# Altium project RS232ToWifi.PrjPcb
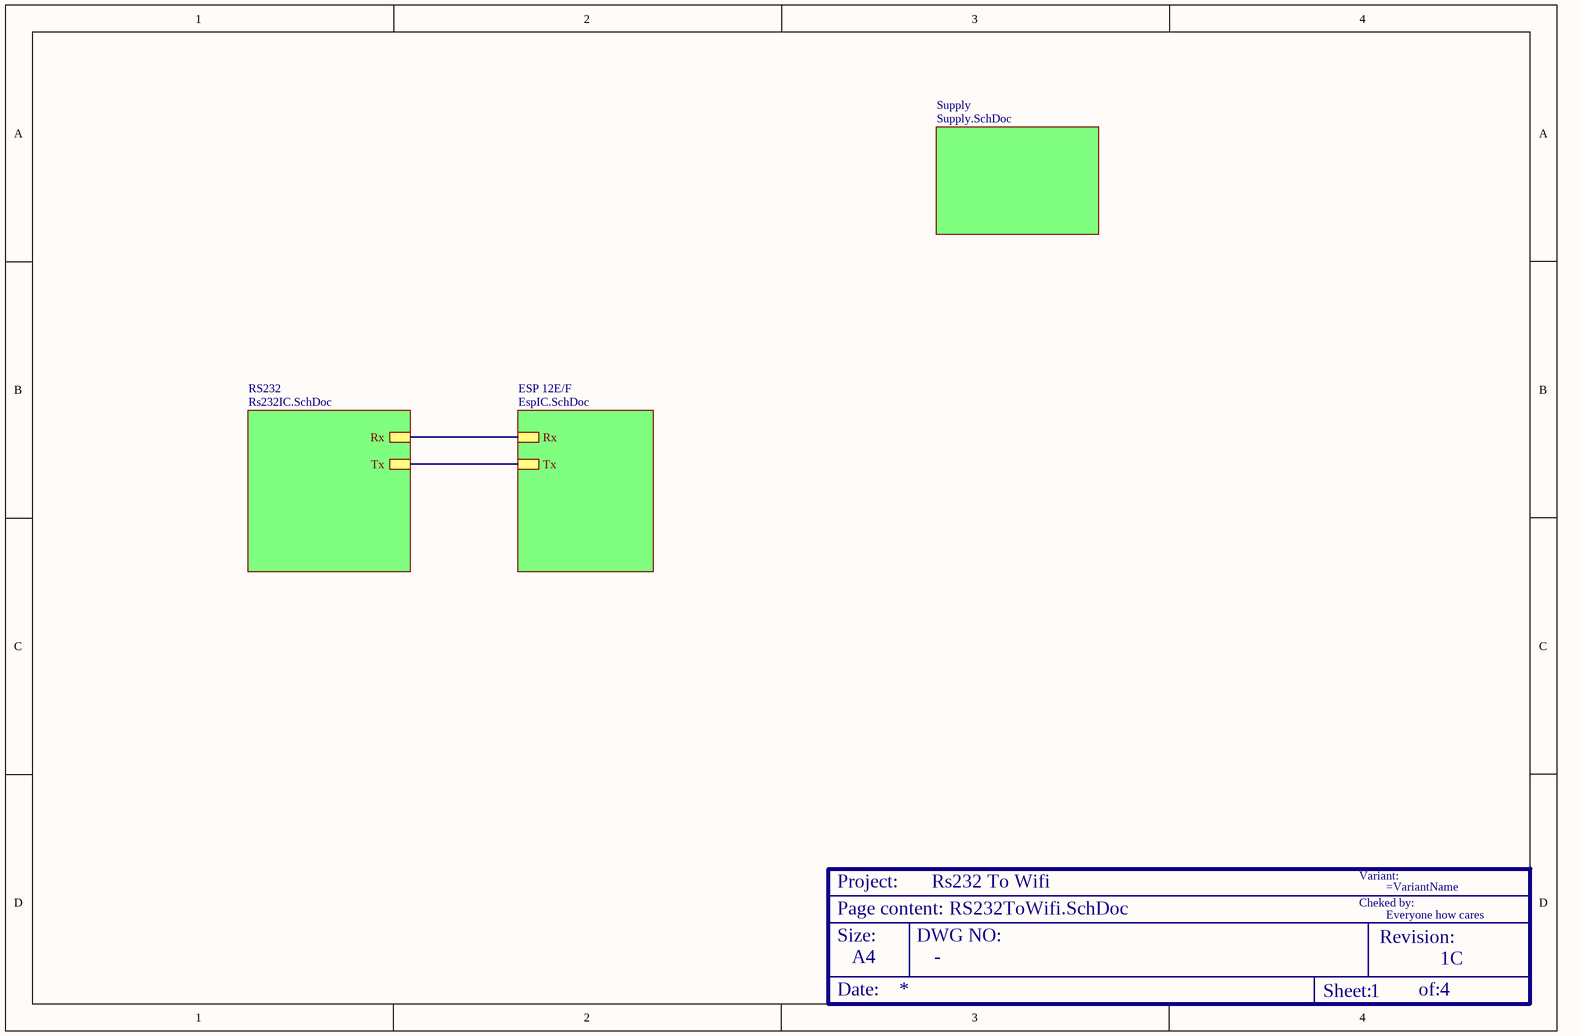
[diagram p0: RS232ToWifi.SchDoc]
P_revision: 1C; P_title: Rs232 To Wifi
4 sheets, 38 parts. Net scope: hierarchical (ports join the sheet entries above them; power ports are global).
Board file: 1551KBK.PcbDoc
Sheets:
  RS232ToWifi.SchDoc
    Supply = Supply.SchDoc
    RS232 = Rs232IC.SchDoc
    ESP 12E/F = EspIC.SchDoc

## Sheet RS232ToWifi.SchDoc
size A4; CheckedBy: Everyone how cares; DocumentNumber: 1; SheetNumber: 1; SheetTotal: 4

### Parts
(Parts that share a designator on the sheet are numbered #1, #2 ... from top to bottom, then left to right.)
?#1  Size: A4  (hidden comment: TitleBox)  (graphical)

### Sub-sheets
ESP 12E/F = EspIC.SchDoc: Tx, Rx
RS232 = Rs232IC.SchDoc: Rx, Tx
Supply = Supply.SchDoc: no entries

### Nets
Rx: sheet RS232/Rx, sheet ESP 12E/F/Rx
Tx: sheet RS232/Tx, sheet ESP 12E/F/Tx

### Notes on the sheet
- (in symbol TitleBox_1) Variant:; Project:; Cheked by:; Page content:; Size:; DWG NO:; Revision:; Date:; Sheet:; of:

### Library data of the parts
?#1 = TitleBox_1: coordenadas: (610;20) Size A4; DWG No: -

## Sheet Supply.SchDoc
size A4; CheckedBy: Everyone how cares; DocumentNumber: 2; SheetNumber: 2; SheetTotal: 4
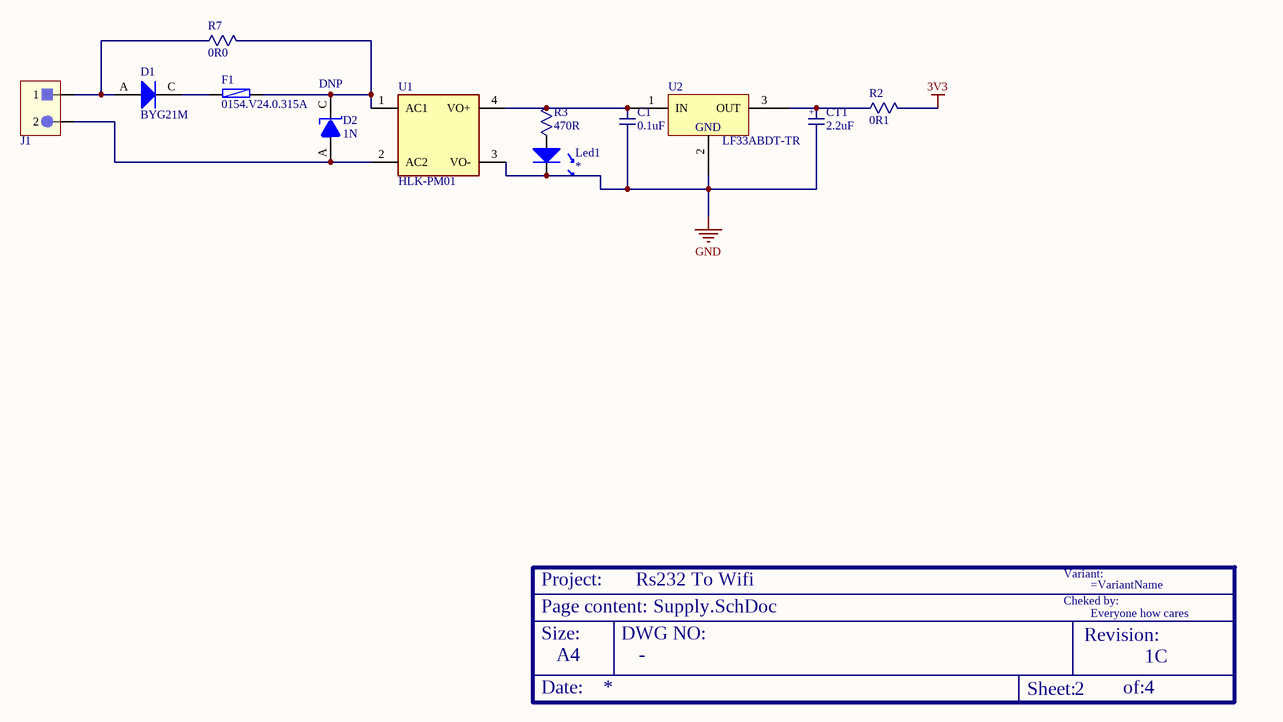
[diagram p1: Supply.SchDoc]

### Parts
(Parts that share a designator on the sheet are numbered #1, #2 ... from top to bottom, then left to right.)
?#2  Size: A4  (hidden comment: TitleBox)  (graphical)
C1  value 0.1uF  [0603C]  (hidden comment: Ceramic Capacitor)
CT1  value 2.2uF  [1206T]  (hidden comment: Tantalum capacitor)
D1  value BYG21M  [DO-214AC]  (hidden comment: DNP)
D2  DNP  value 1N  [1N5359BG]
F1  value 0154.V24.0.315A  [Fuseholder154]  (hidden comment: DNP)
J1  Conector  [691313510002]  (value not drawn)
Led1  Led  [LED_5MM_RED_1C-2A]  (value not drawn)
R2  value 0R1  [0603]  (hidden comment: Res)
R3  value 470R  [0603]  (hidden comment: Res)
R7  value 0R0  [0805]  (hidden comment: Res)
U1  HLK-PM01  [HLK-PM01/ISE]
U2  value LF33ABDT-TR  [DPAK-TO-252-3, CASE369C]  (hidden comment: LDO)

### Nets
3V3: R2.2
GND: C1.2 CT1.2 Led1.C U1.3(VO-) U2.2(GND)
NetC1_1: C1.1 R3.2 U1.4(VO+) U2.1(IN)
NetCT1_1: CT1.1 R2.1 U2.3(OUT)
NetD1_A: D1.A J1.1 R7.1
NetD1_C: D1.C F1.1
NetD2_A: D2.A J1.2 U1.2(AC2)
NetD2_C: D2.C F1.2 R7.2 U1.1(AC1)
NetLed1_A: Led1.A R3.1

### Notes on the sheet
- (in symbol CT) +
- (in symbol TitleBox_1) Variant:; Project:; Cheked by:; Page content:; Size:; DWG NO:; Revision:; Date:; Sheet:; of:

### Library data of the parts
?#2 = TitleBox_1: coordenadas: (610;20) Size A4; DWG No: -
C1 = CC: notas: *
CT1 = CT: Condensador Tantalum; notas: *
D1 = Diode: notas: 24Vin
D2 = Zener Diode: notas: *
F1 = Fusivel_LITTELFUSE_0154: Fusivel SMD LITTELFUSE  0154; notas: 24Vin
J1 = Conector 2 pins: notas: *
R7 = Res: notas: AC
U1 = HLK-PM01: HI-LINK Ultra-compact power module HLK-PM01<p> <ul> <li>Meet UL, CE requirements</li> <li>Ultra-thin, ultra-small</li> <li>All voltage input (AC: 90 ~ 264V)</li> <li>Low ripple and low noise</li> <li>Output overload and short circuit protection</li> <li>High efficiency, high power density</li> <li>The product is designed to meet the requirements of EMC and Safety Test</li> <li>Low power consumption, environmental protection, no-load loss <0.1W</li> <li>100% load aging and testing</li>; Availability: Unavailable; Price: None; SnapEDA_Link: https://www.snapeda.com/parts/hlk-pm01/Hi-link/view-part/2875605/?ref=snap; Value: *; Package: Package Analog Devices; MF: Hi-link; MP: hlk-pm01
U2 = LF33ABDT-TR: ST, LF33ABDT-TR, Fixed LDO Voltage Regulator, 3V to 16V, 400mV Dropout, 3.3Vout, 0.5Aout, TO-252-3; Manufacturer: STMICROELECTRONICS; Input Voltage Min: 3; Input Voltage Max: 16; Output Voltage Nom.: 3.3; Output Current: 0.5; Dropout Voltage Vdo: 400; LDO Regulator Case Style: TO-252; SVHC: No SVHC (15-Jun-2015); Accuracy %: 1%; Base Number: 33; No. of Outputs: 1; Operating Voltage Tolerance +: 2%; Primary Input Voltage: 5.3; Supply Voltage Min: 4.3; Voltage Regulator Type: Fixed<!--FANDB--><div class="features-and-benefits-container"><div class="features-and-benefits-description"><span class="features-benefits-value">The LF33ABDT-TR is a Low-drop Voltage Regulator with inhibit function and 3.3V output voltage. Low quiescent current make it particularly suitable for low-noise, low power applications and especially in battery powered systems. In the 5-pin configuration (PPAK) a shutdown logic control function is available (pin 2, TTL compatible). This means that when the device is used as a local regulator, a part of the board can be put in standby, decreasing the total power consumption. In the 3-terminal configuration, the device has the same electrical performance, but it is fixed in ON state. It requires a capacitor of only 2.2µF for stability, saving board space and costs.</span></div><div class="features-and-benefits-list"><ul class="features-and-benefits-list-list"><li class="features-and-benefits-list-item">Very low drop-out voltage (0.45V)</li><li class="features-and-benefits-list-item">Very low quiescent current (typical 50µA in OFF mode, 500µA in ON mode)</li><li class="features-and-benefits-list-item">500mA Output current</li><li class="features-and-benefits-list-item">Logic-controlled electronic shutdown</li><li class="features-and-benefits-list-item">Internal current and thermal limit</li><li class="features-and-benefits-list-item">Available in ±1% (AB) or ±2% (C) selection at 25°C</li><li class="features-and-benefits-list-item">80; Supplier 1: Farnell; Manufacturer Part Number: LF33ABDT-TR; RoHS: YES; Stock 1: 7182; Pricing 1: 1=0,52, 70=0,33, 200=0,297, 750=0,264, 1250=0,25 (EUR); No. of Pins: 3; Operating Temperature Min: -40; Operating Temperature Max: 125; Packaging: Cut Tape; MSL: -; Operating Temperature Range: -40°C to +125; Supply Voltage Max: 16; Termination Type: SMD; ComponentLink1URL: http://www.farnell.com/datasheets/1902868.pdf; ComponentLink1Description: http://www.farnell.com/datasheets/1902868.pdf; Supplier Part Number 1: 1087183; notas: *
Led1 = Led: notas: *; Value: *
R2 R3 = Res: notas: *

## Sheet Rs232IC.SchDoc
size A4; CheckedBy: Everyone; DocumentNumber: 3; SheetNumber: 3; SheetTotal: 4
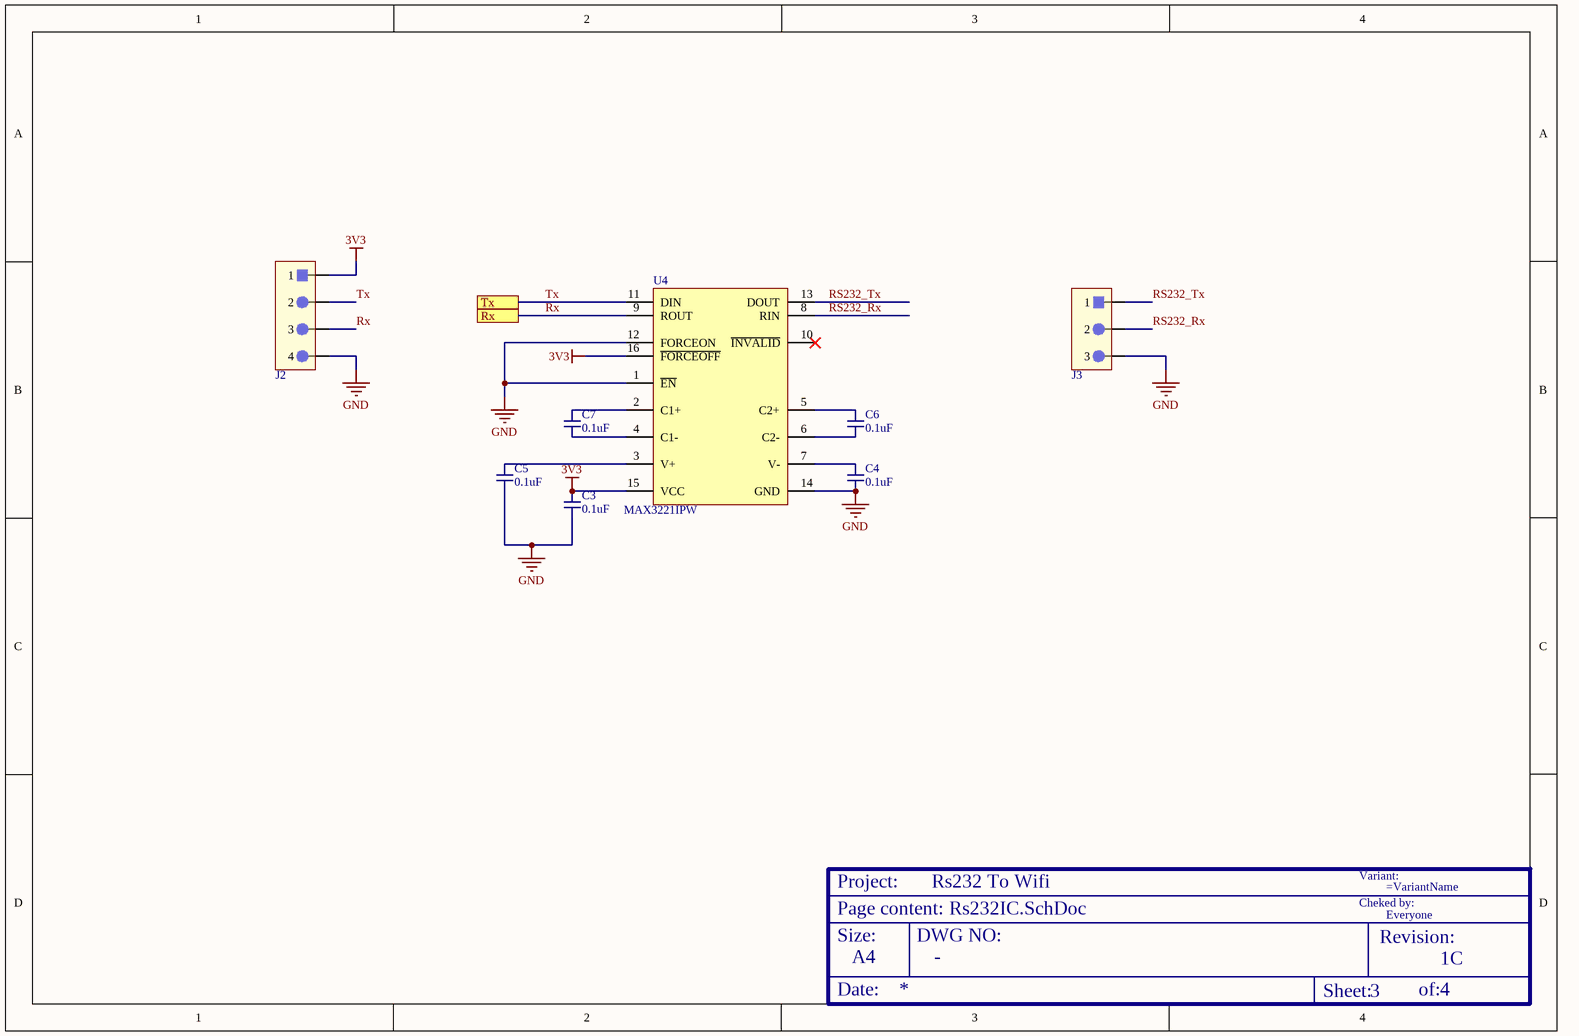
[diagram p2: Rs232IC.SchDoc]

### Parts
(Parts that share a designator on the sheet are numbered #1, #2 ... from top to bottom, then left to right.)
?#3  Size: A4  (hidden comment: TitleBox)  (graphical)
C3  value 0.1uF  [0603C]  (hidden comment: Ceramic Capacitor)
C4  value 0.1uF  [0603C]  (hidden comment: Ceramic Capacitor)
C5  value 0.1uF  [0603C]  (hidden comment: Ceramic Capacitor)
C6  value 0.1uF  [0603C]  (hidden comment: Ceramic Capacitor)
C7  value 0.1uF  [0603C]  (hidden comment: Ceramic Capacitor)
J2  Conector  [61300411121]  (value not drawn)
J3  Conector  [61300311121]  (value not drawn)
U4  value MAX3221IPW  [TI-PW16_M]  (hidden comment: RS232 Serie CI)

### Ports
Rx, Tx

### Nets
3V3: C3.1 J2.1 U4.15(VCC) U4.16(~{FORCEOFF})
GND: C3.2 C4.2 C5.2 J2.4 J3.3 U4.1(~{EN}) U4.12(FORCEON) U4.14(GND)
RS232_Rx: J3.2 U4.8(RIN)
RS232_Tx: J3.1 U4.13(DOUT)
Rx: J2.3 U4.9(ROUT) ; port Rx
Tx: J2.2 U4.11(DIN) ; port Tx
NetC4_1: C4.1 U4.7(V-)
NetC5_1: C5.1 U4.3(V+)
NetC6_1: C6.1 U4.5(C2+)
NetC6_2: C6.2 U4.6(C2-)
NetC7_1: C7.1 U4.2(C1+)
NetC7_2: C7.2 U4.4(C1-)

Not connected (* = marked no-connect by the designer): U4 10(~{INVALID})*

### Notes on the sheet
- (in symbol TitleBox_1) Variant:; Project:; Cheked by:; Page content:; Size:; DWG NO:; Revision:; Date:; Sheet:; of:

### Library data of the parts
?#3 = TitleBox_1: coordenadas: (610;20) Size A4; DWG No: -
C3-C7 = CC: notas: *
J2 = Conector 4 pins: Value: 4; notas: *
J3 = Conector 3 pins: Value: 3; notas: *
U4 = MAX3221IPW: 3-V to 5.5-V Single-Channel RS-232 Line Driver / Receiver with ±15-kV ESD Protection, -40 to 85 degC, 16-Pin TSSOP (PW), Green (RoHS & no Sb/Br); Drivers Per Package: 1; Single Supply: TRUE; ESD HBM(kV): +/-15; Supply Voltage(s)(V): 3.3 or 5.0; ComponentLink1Description: Manufacturer URL; ComponentLink2Description: Datasheet; ComponentLink3Description: Package Specification; ComponentLink3URL: http://www.ti.com/litv/pdf/mpds361; DatasheetVersion: SLLS348M; ComponentLink1URL: www.ti.com; ComponentLink2URL: http://www.ti.com/general/docs/lit/getliterature.tsp?genericPartNumber=MAX3221&fileType=pdf; ICC(Max)(mA): 1; RS-232: TRUE; PackageVersion: revG, Feb-2011; SubFamily: RS-232; PackageDescription: 16-Pin Plastic Thin Small Outline Package 5 x 4.4 mm Body ,0.65 mm Pitch; Receivers Per Package: 1; PackageReference: PW16; PartNumber: MAX3221IPW; notas: *

## Sheet EspIC.SchDoc
size A4; CheckedBy: Everyone how cares; DocumentNumber: 4; SheetNumber: 4; SheetTotal: 4
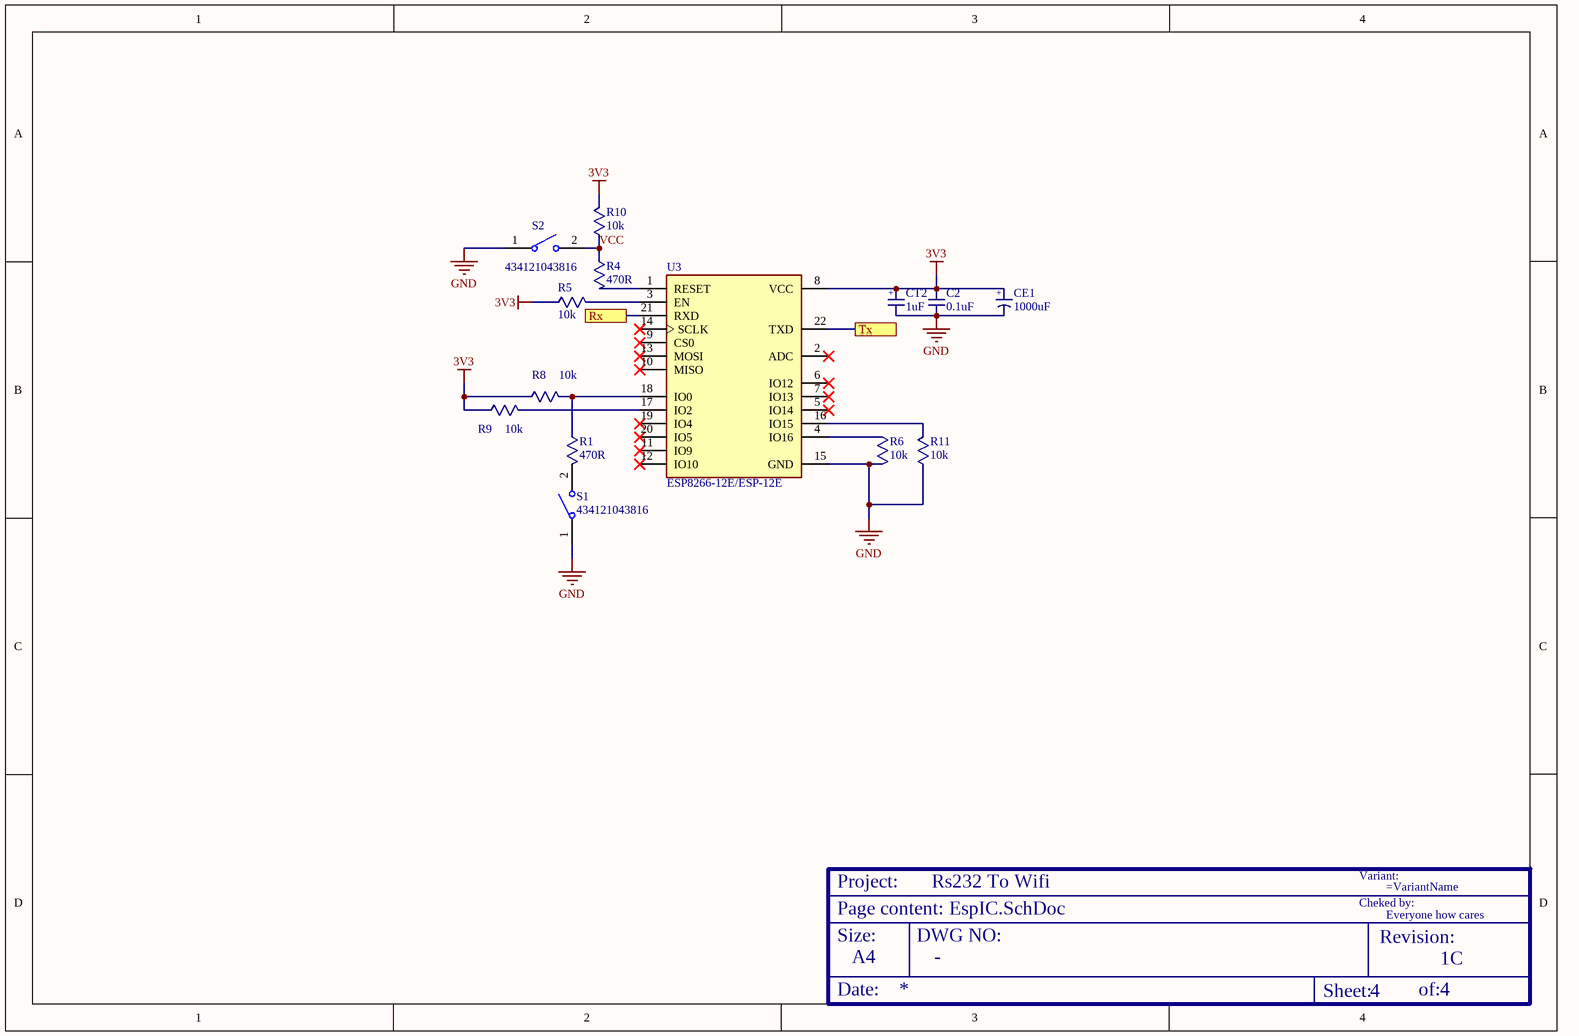
[diagram p3: EspIC.SchDoc]

### Parts
(Parts that share a designator on the sheet are numbered #1, #2 ... from top to bottom, then left to right.)
?#4  Size: A4  (hidden comment: TitleBox)  (graphical)
C2  value 0.1uF  [0603C]  (hidden comment: Ceramic Capacitor)
CE1  value 1000uF  [WCAP-AS5H_8x10.5]  (hidden comment: Eletrolitic Capacitor)
CT2  value 1uF  [0603T]  (hidden comment: Tantalum capacitor)
R1  value 470R  [0603]  (hidden comment: Res)
R4  value 470R  [0603]  (hidden comment: Res)
R5  value 10k  [0603]  (hidden comment: Res)
R6  value 10k  [0603]  (hidden comment: Res)
R8  value 10k  [0603]  (hidden comment: Res)
R9  value 10k  [0603]  (hidden comment: Res)
R10  value 10k  [0603]  (hidden comment: Res)
R11  value 10k  [0603]  (hidden comment: Res)
S1  value 434121043816  [434121043816]  (hidden comment: Swich)
S2  value 434121043816  [434121043816]  (hidden comment: Swich)
U3  ESP8266-12E/ESP-12E  [XCVR_ESP8266-12E/ESP-12E]

### Ports
Rx, Tx

### Nets
3V3: C2.1 CE1.1 CT2.1 R5.1 R8.1 R9.1 R10.2 U3.8(VCC)
GND: C2.2 CE1.2 CT2.2 R6.2 R11.1 S1.1 S2.1 U3.15(GND)
Rx: U3.21(RXD) ; port Rx
Tx: U3.22(TXD) ; port Tx
VCC: R4.1 R10.1 S2.2
NetR1_1: R1.1 R8.2 U3.18(IO0)
NetR1_2: R1.2 S1.2
NetR4_2: R4.2 U3.1(RESET)
NetR5_2: R5.2 U3.3(EN)
NetR6_1: R6.1 U3.4(IO16)
NetR9_2: R9.2 U3.17(IO2)
NetR11_2: R11.2 U3.16(IO15)

Not connected (* = marked no-connect by the designer): U3 2(ADC)* 5(IO14)* 6(IO12)* 7(IO13)* 9(CS0)* 10(MISO)* 11(IO9)* 12(IO10)* 13(MOSI)* 14(SCLK)* 19(IO4)* 20(IO5)*

### Notes on the sheet
- (in symbol CE) +
- (in symbol CT) +
- (in symbol TitleBox_1) Variant:; Project:; Cheked by:; Page content:; Size:; DWG NO:; Revision:; Date:; Sheet:; of:

### Library data of the parts
?#4 = TitleBox_1: coordenadas: (610;20) Size A4; DWG No: -
C2 = CC: notas: *
CE1 = CE: notas: MCVVT6R3M102FB3L
CT2 = CT: Condensador Tantalum; notas: TMCJ1C105MTRF
S1 S2 = switch 2 patas smd: 6x3.5mm SMD WS-TASV, height 4.3 mm, 160 gf; notas: *
U3 = ESP8266-12E/ESP-12E: This WiFi module has a 32-bit MCU micro and clock speeds supporting 80 MHz or 160 MHz. Supports the RTOS and integrated Wi-Fi MAC/BB/RF/PA/LNA, and has an on-board antenna.; MF: AI-Thinker; Price: None; Package: None; Value: *; MP: ESP8266-12E/ESP-12E; Availability: Unavailable; SnapEDA_Link: https://www.snapeda.com/parts/ESP8266-12E/ESP-12E/AI-Thinker/view-part/106414/?ref=snap
R1 R4-R6 R8-R11 = Res: notas: *

## Nets that join several sheets
3V3: Supply (R2.2), Rs232IC (C3.1 J2.1 U4.15 U4.16), EspIC (8 pins)
GND: Supply (5 pins), Rs232IC (8 pins), EspIC (8 pins)
Rx: Rs232IC (J2.3 U4.9), EspIC (U3.21)
Tx: Rs232IC (J2.2 U4.11), EspIC (U3.22)